# EAGLE design rhome_3 (EAGLE 6.5.0)
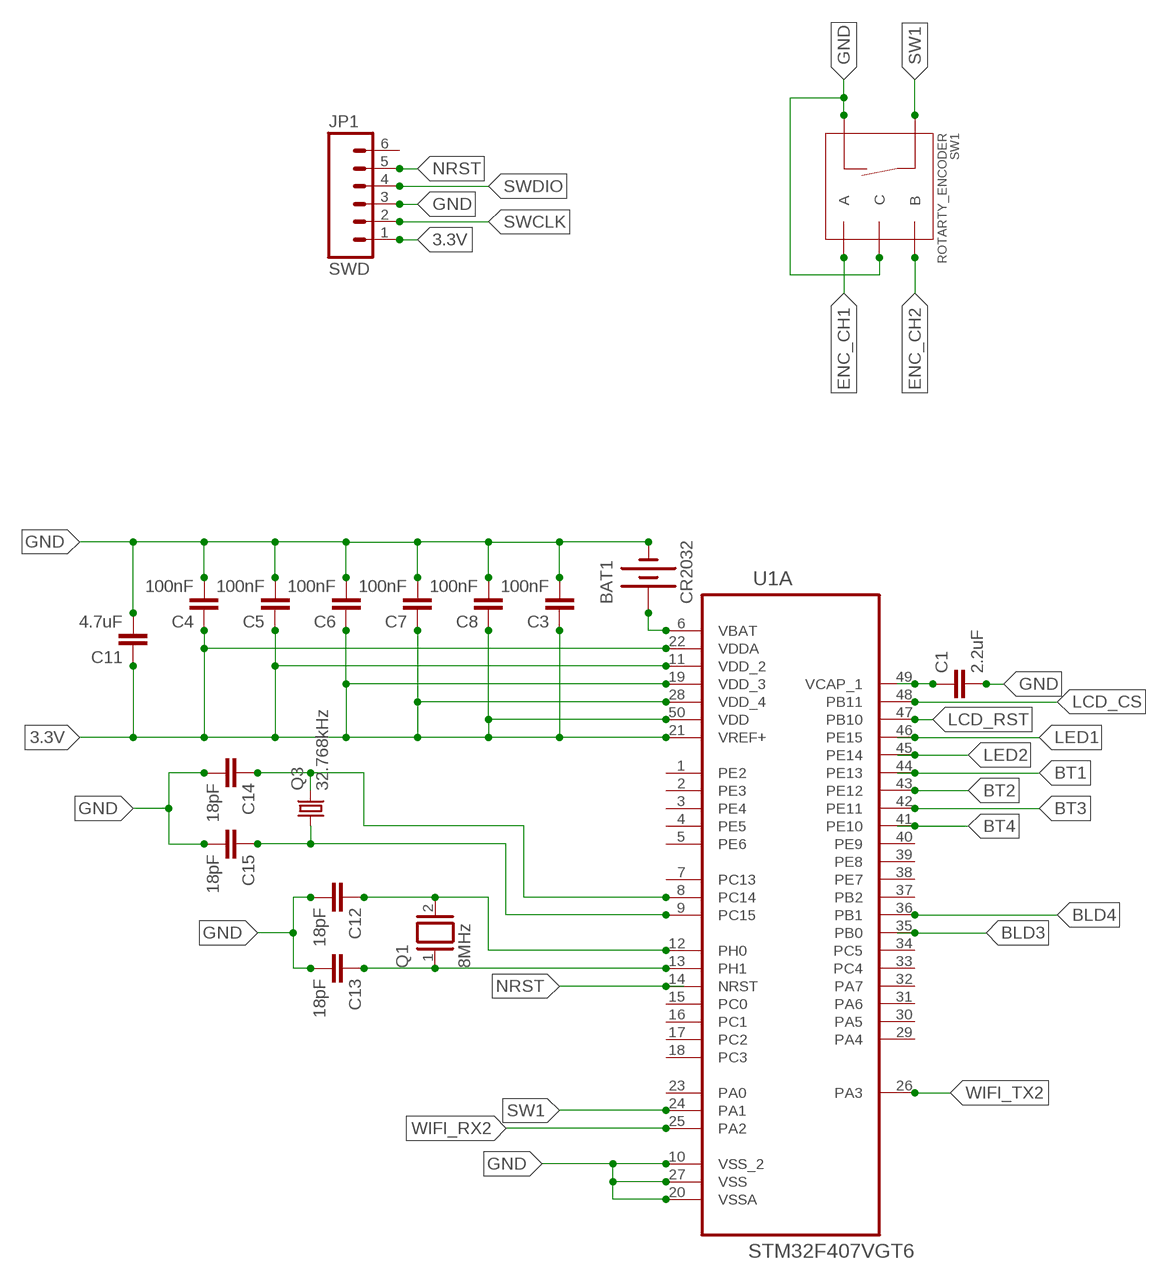
[diagram p0: schematic, sheet 1, part 1 of 2]
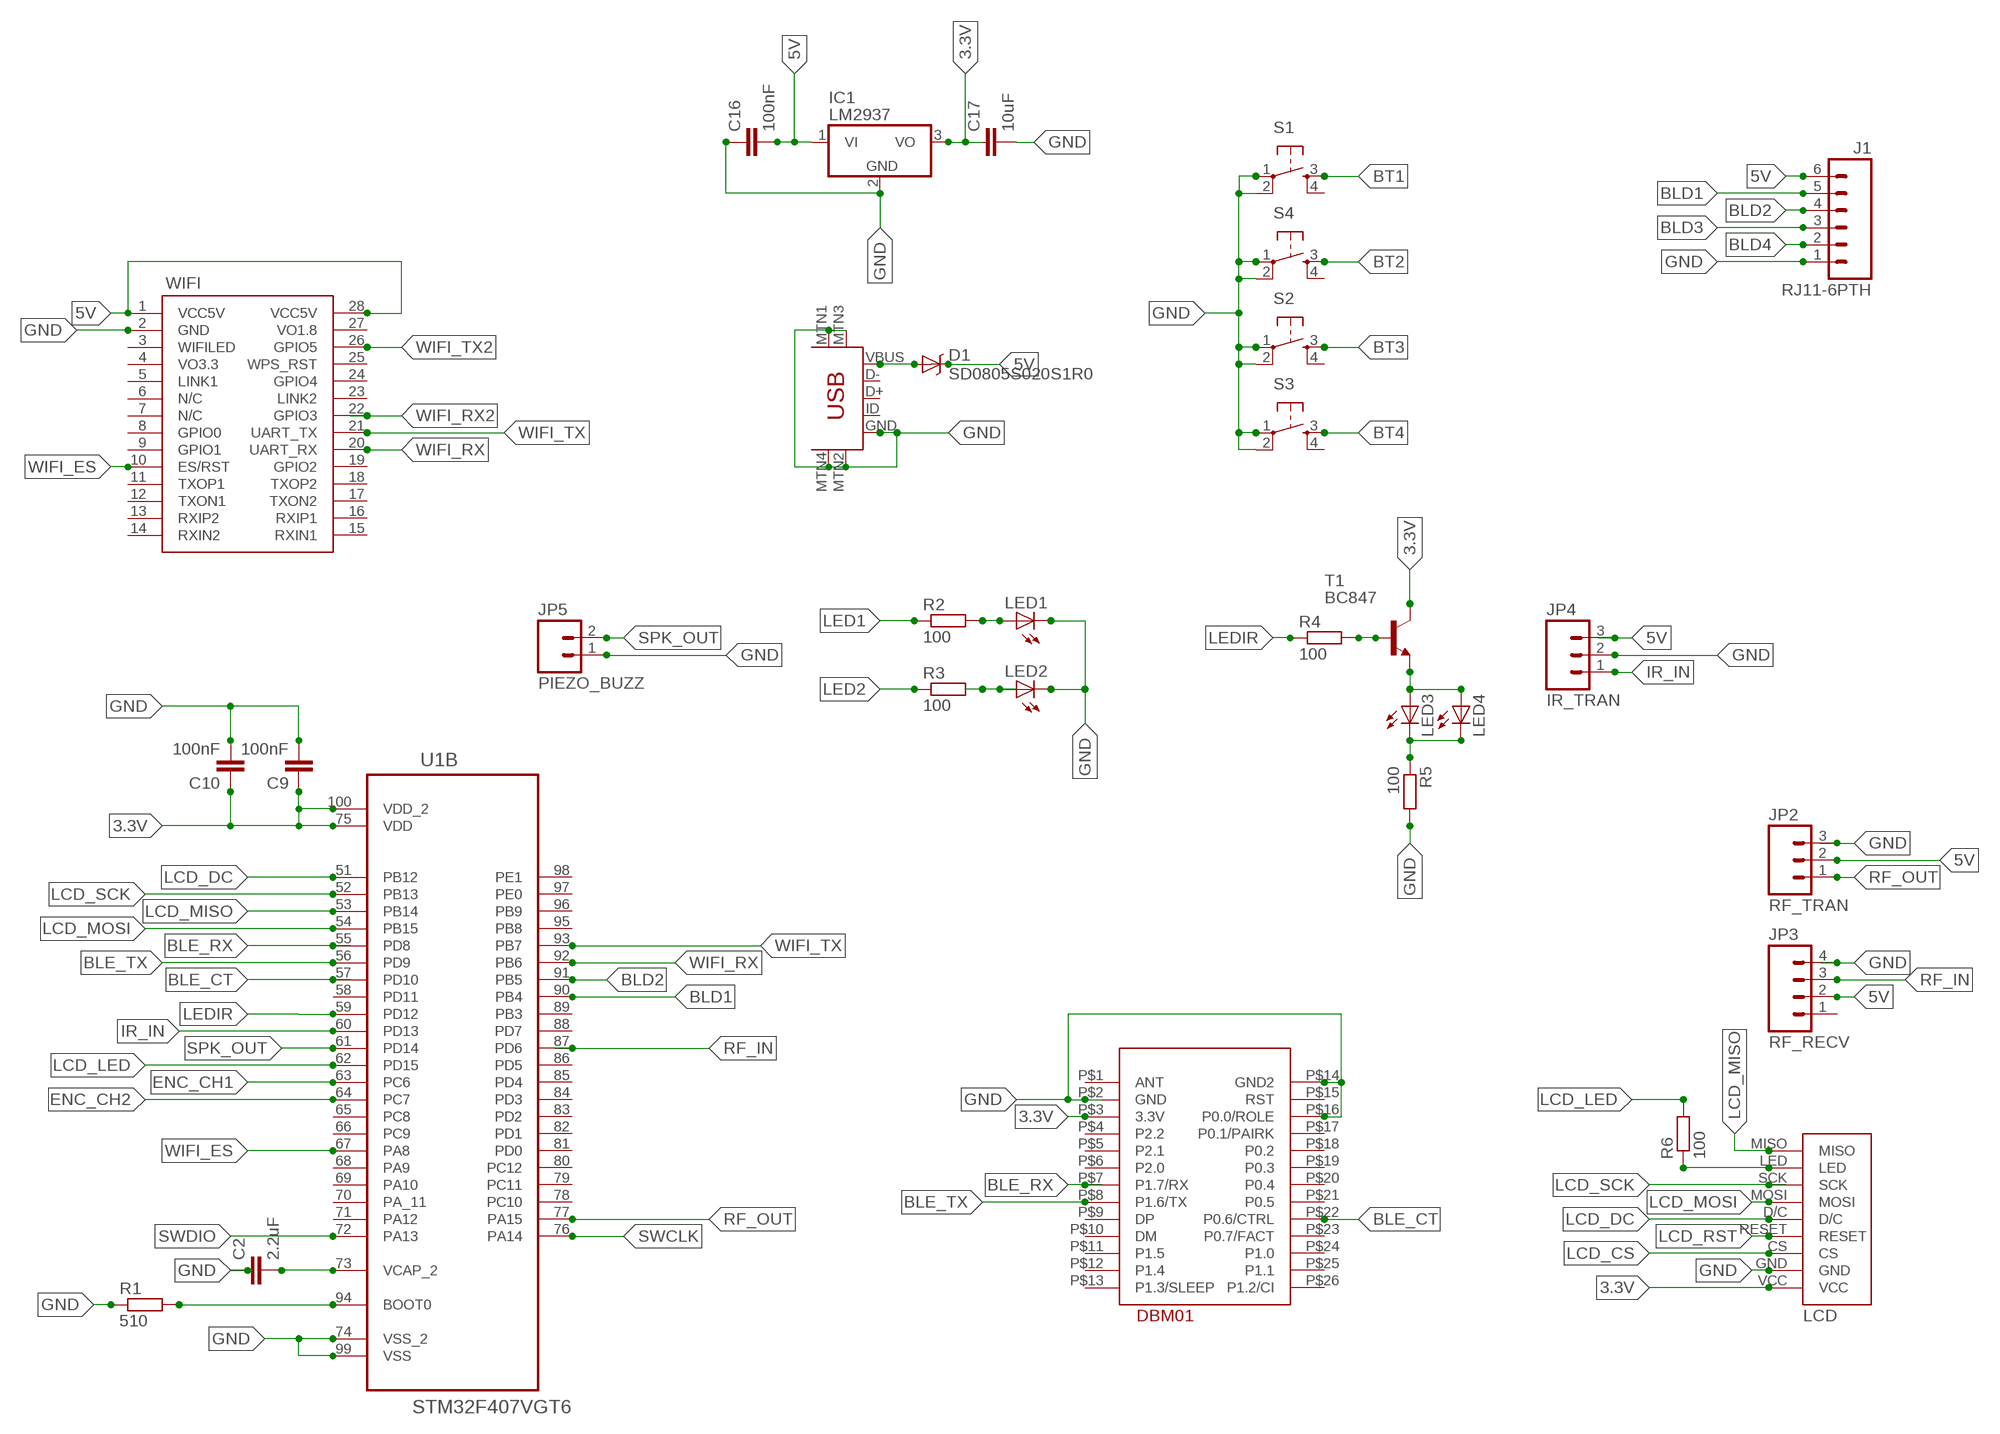
[diagram p1: schematic, sheet 1, part 2 of 2]

## Parts
BAT1  CR2032  BATTERY20SMD  [BATTCON_20MM]
C1  2.2uF  CAP0805  [0805]
C2  2.2uF  CAP0805  [0805]
C3  100nF  CAP0805  [0805]
C4  100nF  CAP0805  [0805]
C5  100nF  CAP0805  [0805]
C6  100nF  CAP0805  [0805]
C7  100nF  CAP0805  [0805]
C8  100nF  CAP0805  [0805]
C9  100nF  CAP0805  [0805]
C10  100nF  CAP0805  [0805]
C11  4.7uF  CAP0805  [0805]
C12  18pF  CAP0805  [0805]
C13  18pF  CAP0805  [0805]
C14  18pF  CAP0805  [0805]
C15  18pF  CAP0805  [0805]
C16  100nF  CAP0805  [0805]
C17  10uF  CAP0805  [0805]
D1  SD0805S020S1R0  BAT20JFILM  [SOD-323]
DBM01  DBM01  [SMD]
IC1  LM2937  [TO263-3]
J1  RJ11-6PTH  [RJ11-6]
JP1  SWD  M06SIP  [1X06]
JP2  RF_TRAN  M03PTH  [1X03]
JP3  RF_RECV  M04PTH  [1X04]
JP4  IR_TRAN  M03PTH  [1X03]
JP5  PIEZO_BUZZ  M02LOCK  [1X02_LOCK]
LCD  ILI9341_SPI_LCD  [LCD]
LED1  LED5MM  [LED5MM]
LED2  LED5MM  [LED5MM]
LED3  LED5MM  [LED5MM]
LED4  LED5MM  [LED5MM]
Q1  8MHz  XTAL/S  [QS]
Q3  32.768kHz  MC-306  [MC-306]
R1  510  R-EU_R0805  [R0805]
R2  100  R-EU_R0805  [R0805]
R3  100  R-EU_R0805  [R0805]
R4  100  R-EU_R0805  [R0805]
R5  100  R-EU_R0805  [R0805]
R6  100  R-EU_R0805  [R0805]
S1  TAC_SWITCHPTH  [TACTILE-PTH]
S2  TAC_SWITCHPTH  [TACTILE-PTH]
S3  TAC_SWITCHPTH  [TACTILE-PTH]
S4  TAC_SWITCHPTH  [TACTILE-PTH]
SW1  ROTARTY_ENCODER  [ROTARY_ENC_PLAIN]
T1  BC847  [SOT23]
U1  STM32F407VGT6  [QFP50P1600X1600X160-100N]
U$1  USB-MINIB-5PIN  [USB-MINIB]
WIFI  HLK-RM04  [HLK-RM04]

## Nets
3.3V: C3.1 C4.1 C5.1 C6.1 C7.1 C8.1 C9.1 C10.1 C11.1 C17.1 DBM01.P$3(3.3V) IC1.3(VO) JP1.1 LCD.VCC T1.3(C) U1.11(A:VDD_2) U1.19(A:VDD_3) U1.21(A:VREF+) U1.22(A:VDDA) U1.28(A:VDD_4) U1.50(A:VDD) U1.75(B:VDD) U1.100(B:VDD_2)
5V: C16.2 D1.1(C) IC1.1(VI) J1.6 JP2.2 JP3.2 JP4.3 WIFI.1(VCC5V) WIFI.28(VCC5V)
BLD1: J1.5 U1.90(B:PB4)
BLD2: J1.4 U1.91(B:PB5)
BLD3: J1.3 U1.35(A:PB0)
BLD4: J1.2 U1.36(A:PB1)
BLE_CT: DBM01.P$22(P0.6/CTRL) U1.57(B:PD10)
BLE_RX: DBM01.P$7(P1.7/RX) U1.55(B:PD8)
BLE_TX: DBM01.P$8(P1.6/TX) U1.56(B:PD9)
BT1: S1.3 U1.44(A:PE13)
BT2: S4.3 U1.43(A:PE12)
BT3: S2.3 U1.42(A:PE11)
BT4: S3.3 U1.41(A:PE10)
ENC_CH1: SW1.A U1.63(B:PC6)
ENC_CH2: SW1.B U1.64(B:PC7)
GND: BAT1.2(-) C1.2 C2.1 C3.2 C4.2 C5.2 C6.2 C7.2 C8.2 C9.2 C10.2 C11.2 C12.2 C13.2 C14.2 C15.2 C16.1 C17.2 DBM01.P$2(GND) DBM01.P$14(GND2) DBM01.P$16(P0.0/ROLE) IC1.2(GND) J1.1 JP1.3 JP2.3 JP3.4 JP4.2 JP5.1 LCD.GND LED1.K(C) LED2.K(C) R1.1 R5.2 S1.1 S1.2 S2.1 S2.2 S3.1 S3.2 S4.1 S4.2 SW1.C SW1.SW- U1.10(A:VSS_2) U1.20(A:VSSA) U1.27(A:VSS) U1.74(B:VSS_2) U1.99(B:VSS) U$1.GND U$1.MTN1(MTN2) U$1.MTN2(MTN3) U$1.MTN3(MTN1) U$1.MTN4 WIFI.2(GND)
IR_IN: JP4.1 U1.60(B:PD13)
LCD_CS: LCD.CS U1.48(A:PB11)
LCD_DC: LCD.D/C U1.51(B:PB12)
LCD_LED: R6.2 U1.62(B:PD15)
LCD_MISO: LCD.MISO U1.53(B:PB14)
LCD_MOSI: LCD.MOSI U1.54(B:PB15)
LCD_RST: LCD.RESET U1.47(A:PB10)
LCD_SCK: LCD.SCK U1.52(B:PB13)
LED1: R2.1 U1.46(A:PE15)
LED2: R3.1 U1.45(A:PE14)
LEDIR: R4.1 U1.59(B:PD12)
N$1: C2.2 U1.73(B:VCAP_2)
N$3: C1.1 U1.49(A:VCAP_1)
N$4: C14.1 Q3.4 U1.8(A:PC14)
N$5: C13.1 Q1.1 U1.13(A:PH1)
N$6: C12.1 Q1.2 U1.12(A:PH0)
N$7: C15.1 Q3.1 U1.9(A:PC15)
N$8: D1.2(A) U$1.VBUS
N$9: BAT1.1(+) U1.6(A:VBAT)
N$10: LED1.A R2.2
N$11: LED2.A R3.2
N$12: R4.2 T1.1(B)
N$13: LED3.A LED4.A T1.2(E)
N$14: R1.2 U1.94(B:BOOT0)
N$15: LED3.K(C) LED4.K(C) R5.1
N$17: LCD.LED R6.1
NRST: JP1.5 U1.14(A:NRST)
RF_IN: JP3.3 U1.87(B:PD6)
RF_OUT: JP2.1 U1.77(B:PA15)
SPK_OUT: JP5.2 U1.61(B:PD14)
SW1: SW1.SW+ U1.24(A:PA1)
SWCLK: JP1.2 U1.76(B:PA14)
SWDIO: JP1.4 U1.72(B:PA13)
WIFI_ES: U1.67(B:PA8) WIFI.10(ES/RST)
WIFI_RX: U1.92(B:PB6) WIFI.20(UART_RX)
WIFI_RX2: U1.25(A:PA2) WIFI.22(GPIO3)
WIFI_TX: U1.93(B:PB7) WIFI.21(UART_TX)
WIFI_TX2: U1.26(A:PA3) WIFI.26(GPIO5)
Unconnected: DBM01.P$1(ANT) DBM01.P$4(P2.2) DBM01.P$5(P2.1) DBM01.P$6(P2.0) DBM01.P$9(DP) DBM01.P$10(DM) DBM01.P$11(P1.5) DBM01.P$12(P1.4) DBM01.P$13(P1.3/SLEEP) DBM01.P$15(RST) DBM01.P$17(P0.1/PAIRK) DBM01.P$18(P0.2) DBM01.P$19(P0.3) DBM01.P$20(P0.4) DBM01.P$21(P0.5) DBM01.P$23(P0.7/FACT) DBM01.P$24(P1.0) DBM01.P$25(P1.1) DBM01.P$26(P1.2/CI) JP1.6 JP3.1 S1.4 S2.4 S3.4 S4.4 U1.1(A:PE2) U1.2(A:PE3) U1.3(A:PE4) U1.4(A:PE5) U1.5(A:PE6) U1.7(A:PC13) U1.15(A:PC0) U1.16(A:PC1) U1.17(A:PC2) U1.18(A:PC3) U1.23(A:PA0) U1.29(A:PA4) U1.30(A:PA5) U1.31(A:PA6) U1.32(A:PA7) U1.33(A:PC4) U1.34(A:PC5) U1.37(A:PB2) U1.38(A:PE7) U1.39(A:PE8) U1.40(A:PE9) U1.58(B:PD11) U1.65(B:PC8) U1.66(B:PC9) U1.68(B:PA9) U1.69(B:PA10) U1.70(B:PA_11) U1.71(B:PA12) U1.78(B:PC10) U1.79(B:PC11) U1.80(B:PC12) U1.81(B:PD0) U1.82(B:PD1) U1.83(B:PD2) U1.84(B:PD3) U1.85(B:PD4) U1.86(B:PD5) U1.88(B:PD7) U1.89(B:PB3) U1.95(B:PB8) U1.96(B:PB9) U1.97(B:PE0) U1.98(B:PE1) U$1.D+ U$1.D- U$1.ID WIFI.3(WIFILED) WIFI.4(VO3.3) WIFI.5(LINK1) WIFI.6(N/C) WIFI.7(N/C) WIFI.8(GPIO0) WIFI.9(GPIO1) WIFI.11(TXOP1) WIFI.12(TXON1) WIFI.13(RXIP2) WIFI.14(RXIN2) WIFI.15(RXIN1) WIFI.16(RXIP1) WIFI.17(TXON2) WIFI.18(TXOP2) WIFI.19(GPIO2) WIFI.23(LINK2) WIFI.24(GPIO4) WIFI.25(WPS_RST) WIFI.27(VO1.8)

## Library data of the parts
BAT1 = SparkFun-Electromechanical:BATTERY: Battery Holders Various common sizes : AA, AAA, 20mm coin cell and 12mm coin cell. 20MM_4LEGS, BATT-10373
C1-C17 = SparkFun-Capacitors:CAP: Capacitor Standard 0603 ceramic capacitor, and 0.1" leaded capacitor.
D1 = SparkFun-DiscreteSemi:BAT20JFILM: 23V, 1A Schottky diode, SOD-323 package; PROD_ID: DIO-11623; VALUE: BAT20JFILM
DBM01 = roli_lib:DBM01: DBM01 Bluetooth low energy module dorji.com
IC1 = linear:LM2937: LM2937-2.5, LM2937-3.3 400mA and 500mA Voltage Regulators Source: http://cache.national.com/ds/LM/LM2937-2.5.pdf
J1 = SparkFun-Connectors:RJ11-6: RJ11 Jack Simple 6 pin RJ11 jack. Commonly found on CAT3 devices and Microchip programmers. SKU: PRT-00132
JP1 = SparkFun-Connectors:M06: Header 6 Standard 6-pin 0.1" header. Use with straight break away headers (SKU : PRT-00116), right angle break away headers (PRT-00553), swiss pins (PRT-00743), machine pins (PRT-00117), and female headers (PRT-00115). Molex polarized connector foot print use with SKU : PRT-08094 with associated crimp pins and housings. NOTES ON THE VARIANTS LOCK and LOCK_LONGPADS... This footprint was designed to help hold the alignment of a through-hole component (i.e. 6-pin header) while soldering it into place. You may notice that each hole has been shifted either up or down by 0.005 of an inch from it's more standard position (which is a perfectly straight line). This slight alteration caused the pins (the squares in the middle) to touch the edges of the holes. Because they are alternating, it causes a "brace" to hold the component in place. 0.005 has proven to be the perfect amount of "off-center" position when using our standard breakaway headers. Although looks a little odd when you look at the bare footprint, once you have a header in there, the alteration is very hard to notice. Also,if you push a header all the way into place, it is covered up entirely on the bottom side. This idea of altering the position of holes to aid alignment will be further integrated into the Sparkfun Library for other footprints. It can help hold any component with 3 or more connection pins.
JP2 JP4 = SparkFun-Connectors:M03: Header 3 Standard 3-pin 0.1" header. Use with straight break away headers (SKU : PRT-00116), right angle break away headers (PRT-00553), swiss pins (PRT-00743), machine pins (PRT-00117), and female headers (PRT-00115). Molex polarized connector foot print use with SKU : PRT-08232 with associated crimp pins and housings.
JP3 = SparkFun-Connectors:M04: Header 4 Standard 4-pin 0.1" header. Use with straight break away headers (SKU : PRT-00116), right angle break away headers (PRT-00553), swiss pins (PRT-00743), machine pins (PRT-00117), and female headers (PRT-00115). Molex polarized connector foot print use with SKU : PRT-08231 with associated crimp pins and housings. 1MM SMD Version SKU: PRT-10208
JP5 = SparkFun-Connectors:M02: Standard 2-pin 0.1" header. Use with - straight break away headers ( PRT-00116) - right angle break away headers (PRT-00553) - swiss pins (PRT-00743) - machine pins (PRT-00117) - female headers (PRT-00115) Molex polarized connector foot print use with: PRT-08233 with associated crimp pins and housings. 2.54_SCREWTERM for use with PRT-10571. 3.5mm Screw Terminal footprints for PRT-08084 5mm Screw Terminal footprints for use with PRT-08433
LCD = roli_lib:ILI9341_SPI_LCD: 2.2" LCD with ILI9341 SPI controller Commonly found on ebay for a few $ 320x240 resolution
LED1-LED4 = led:LED: LED OSRAM: - CHIPLED LG R971, LG N971, LY N971, LG Q971, LY Q971, LO R971, LY R971 LH N974, LH R974 LS Q976, LO Q976, LY Q976 LO Q996 - Hyper CHIPLED LW Q18S LB Q993, LB Q99A, LB R99A - SideLED LS A670, LO A670, LY A670, LG A670, LP A670 LB A673, LV A673, LT A673, LW A673 LH A674 LY A675 LS A676, LA A676, LO A676, LY A676, LW A676 LS A679, LY A679, LG A679 - Hyper Micro SIDELED® LS Y876, LA Y876, LO Y876, LY Y876 LT Y87S - SmartLED LW L88C, LW L88S LB L89C, LB L89S, LG L890 LS L89K, LO L89K, LY L89K LS L896, LA L896, LO L896, LY L896 - TOPLED LS T670, LO T670, LY T670, LG T670, LP T670 LSG T670, LSP T670, LSY T670, LOP T670, LYG T670 LG T671, LOG T671, LSG T671 LB T673, LV T673, LT T673, LW T673 LH T674 LS T676, LA T676, LO T676, LY T676, LB T676, LH T676, LSB T676, LW T676 LB T67C, LV T67C, LT T67C, LS T67K, LO T67K, LY T67K, LW E67C LS E67B, LA E67B, LO E67B, LY E67B, LB E67C, LV E67C, LT E67C LW T67C LS T679, LY T679, LG T679 LS T770, LO T770, LY T770, LG T770, LP T770 LB T773, LV T773, LT T773, LW T773 LH T774 LS E675, LA E675, LY E675, LS T675 LS T776, LA T776, LO T776, LY T776, LB T776 LHGB T686 LT T68C, LB T68C - Hyper Mini TOPLED® LB M676 - Mini TOPLED Santana® LG M470 LS M47K, LO M47K, LY M47K Source: http://www.osram.convergy.de LUXEON: - LUMILED® LXK2-PW12-R00, LXK2-PW12-S00, LXK2-PW14-U00, LXK2-PW14-V00 LXK2-PM12-R00, LXK2-PM12-S00, LXK2-PM14-U00 LXK2-PE12-Q00, LXK2-PE12-R00, LXK2-PE12-S00, LXK2-PE14-T00, LXK2-PE14-U00 LXK2-PB12-K00, LXK2-PB12-L00, LXK2-PB12-M00, LXK2-PB14-N00, LXK2-PB14-P00, LXK2-PB14-Q00 LXK2-PR12-L00, LXK2-PR12-M00, LXK2-PR14-Q00, LXK2-PR14-R00 LXK2-PD12-Q00, LXK2-PD12-R00, LXK2-PD12-S00 LXK2-PH12-R00, LXK2-PH12-S00 LXK2-PL12-P00, LXK2-PL12-Q00, LXK2-PL12-R00 Source: www.luxeon.com KINGBRIGHT: KA-3528ASYC Source: www.kingbright.com
Q1 = special:XTAL/S: CRYSTAL
Q3 = crystal:MC-306: kHz RANGE CRYSTAL UNIT SMD Source: MC-306_405_406_E07X.PDF Homepage <http://www.epsontoyocom.co.jp>; MPN: MC-306 60.0KHZ 100PPM ,12.5PF; OC_FARNELL: 1278040; OC_NEWARK: 31M5576
R1-R6 = resistor:R-EU_: RESISTOR, European symbol
S1-S4 = SparkFun-Electromechanical:TAC_SWITCH: Momentary Switch Button commonly used for reset or general input. Spark Fun Electronics SKU : COM-00097 SMT- SWCH-08247
SW1 = SparkFun-Electromechanical:ROTARTY_ENCODER: Simple no LED rotary encoder Example: COM-09117
T1 = transistor:BC847: NPN TRANSISTOR
U1 = stm32f4:STM32F407VGT6: IC, MCU, 32BIT, 1MB FLASH, 100LQFP; MPN: STM32F407VGT6; OC_FARNELL: 2064368; OC_NEWARK: 73T2333; PACKAGE: 100LQFP; SUPPLIER: STMicroelectronics
U$1 = SparkFun-Connectors:USB-MINIB: Mini-USB "B" connector with 5th pin broken out. Created new symbol breaking out 5th "ID" pin in mini/micro USB connector spec. See: http://en.wikipedia.org/wiki/Mini_usb#Cables. Uses same footprint as 4-pin symbol. Also added pins to connect to mounting / shield pads if required (probably not generally needed as signals aren't shielded once they leave the connector).
WIFI = solderandflux:HLK-RM04

## Net classes
0 default: width 0.152 mm, drill 0.33 mm, clearance 0.152 mm

## Board
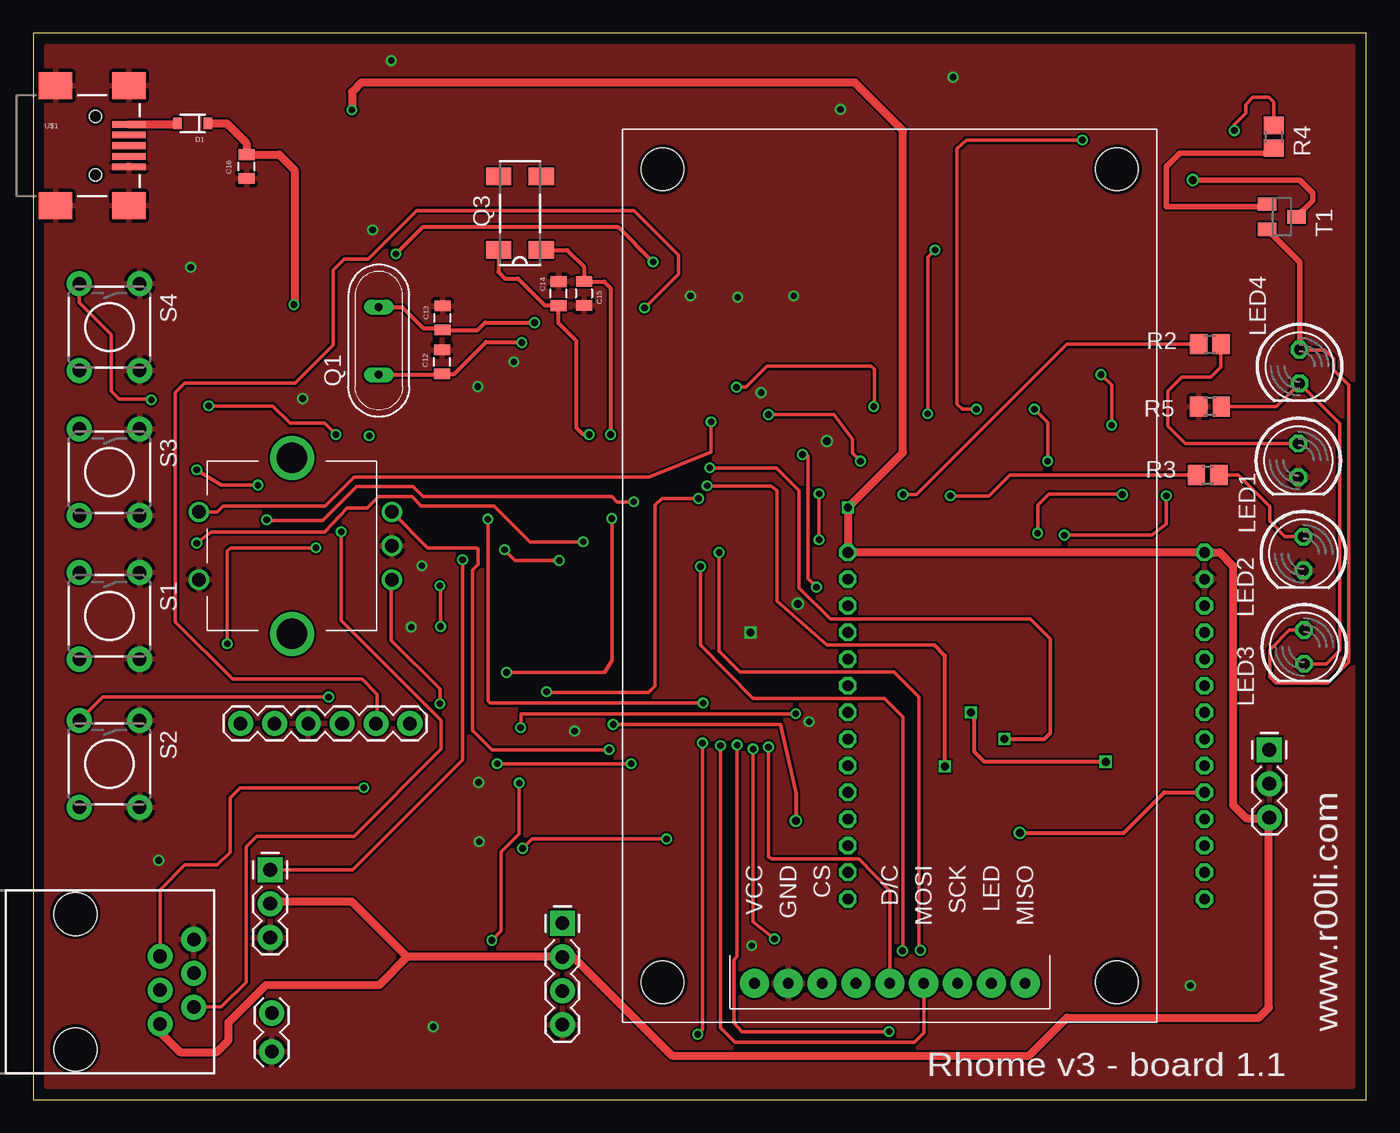
[diagram p2: board, top side]
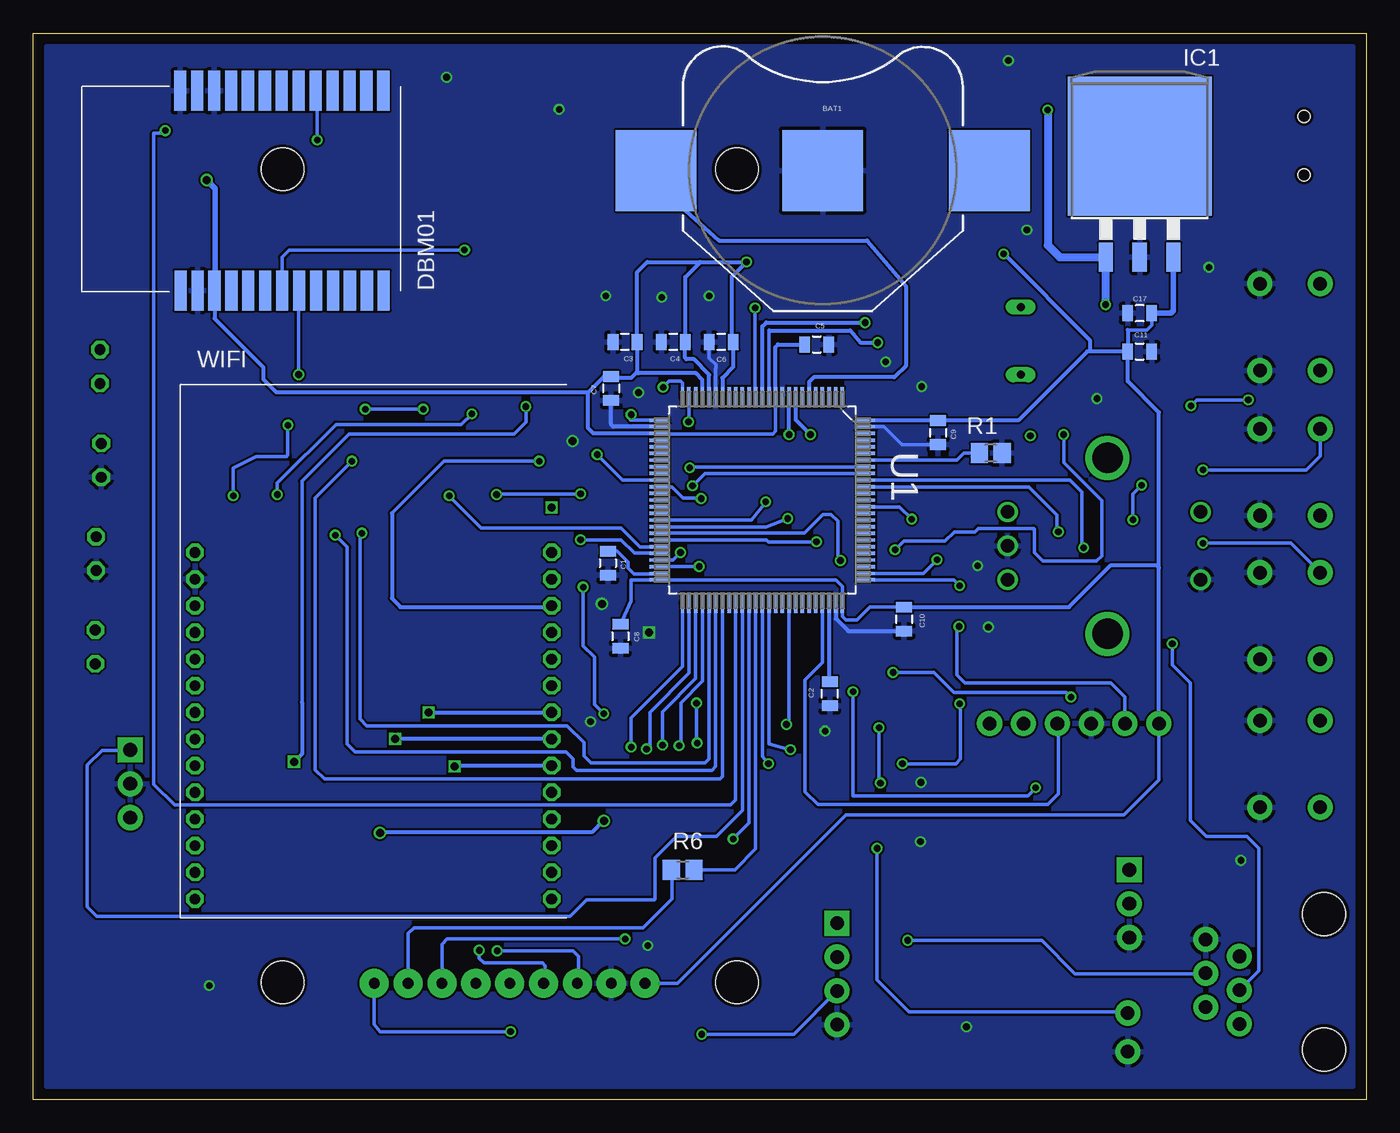
[diagram p3: board, bottom side, seen from below]

Size 100 x 80 mm. Coordinates in mm from the lower left corner, seen from the top.
Outline: 0,80 0,0 100,0 100,80 0,80
Copper layers (1*16): Top 0.035mm / dielectric 1.5mm / Bottom 0.035mm
Design rules "Elecrow_2-layer_eagle_rule": minimum track width 6mil, minimum drill 12mil, track to track 6mil, track to pad 6mil, pad to pad 6mil, via to via 6mil, smd to smd 0mil, copper to edge 10mil, drill to drill 10mil, minimum pad ring 10mil, minimum via ring 6mil, stop-mask expansion 2mil, vias tented up to drill 100mil, thermal gap 10mil

### Footprints (pad centres in the part's own frame; a part is rotated, then mirrored left to right if it is on the bottom)
BATTCON_20MM = smd 6.07 x 6.07: 1 -12.5,0; 2 0,0; 3 12.5,0
0805 = smd 0.8 x 1.2: 1 -0.9,0; 2 0.9,0
SOD-323 = smd 0.63 x 0.83: 1 -1.15,0; 2 1.15,0
SMD = smd 3 x 0.91: P$1 -7.62,6.35; P$2 -7.62,5.08; P$3 -7.62,3.81; P$4 -7.62,2.54; P$5 -7.62,1.27; P$6 -7.62,0; P$7 -7.62,-1.27; P$8 -7.62,-2.54; P$9 -7.62,-3.81; P$10 -7.62,-5.08; P$11 -7.62,-6.35; P$12 -7.62,-7.62; P$13 -7.62,-8.89; P$14 7.36,6.38; P$15 7.36,5.11; P$16 7.36,3.84; P$17 7.36,2.57; P$18 7.36,1.3; P$19 7.36,0.03; P$20 7.36,-1.24; P$21 7.36,-2.51; P$22 7.36,-3.78; P$23 7.36,-5.05; P$24 7.36,-6.32; P$25 7.36,-7.59; P$26 7.36,-8.86
TO263-3 = smd 1.067 x 2.159: 1 -2.54,-5.791; 2 0,-5.791; 3 2.54,-5.791 | smd 10.8 x 10.41: TAB 0,2.54
RJ11-6 = drill 1.016 pad 1.88: 1 1.905,8.89; 2 3.175,6.35; 3 4.445,8.89; 4 5.715,6.35; 5 6.985,8.89; 6 8.255,6.35 | hole 3.251: 0,0; 10.16,0
1X06 = drill 1.016 pad 1.88: 1 0,0; 2 2.54,0; 3 5.08,0; 4 7.62,0; 5 10.16,0; 6 12.7,0
1X03 = drill 1.016 pad 1.88 square: 1 0,0 | drill 1.016 pad 1.88: 2 2.54,0; 3 5.08,0
1X04 = drill 1.016 pad 1.88 square: 1 0,0 | drill 1.016 pad 1.88: 2 2.54,0; 3 5.08,0; 4 7.62,0
1X02_LOCK = drill 1.016 pad 1.88: 1 -0.178,0; 2 2.718,0
LCD = drill 0.8 pad 2.184: CS 30.48,-5.08; D/C 30.48,0; GND 30.48,-7.62; LED 30.48,7.62; MISO 30.48,10.16; MOSI 30.48,2.54; RESET 30.48,-2.54; SCK 30.48,5.08; VCC 30.48,-10.16 | hole 3.2: 30.4,17.05; 30.4,-17.05; -30.6,17.05; -30.6,-17.05
LED5MM = drill 0.813 octagon: A -1.27,0; K 1.27,0
QS = drill 0.61 long: 1 -2.54,0; 2 2.54,0
MC-306 = smd 1.3 x 1.9: 1 -2.75,-1.6; 2 2.75,-1.6; 3 2.75,1.6; 4 -2.75,1.6
R0805 = smd 1.3 x 1.5: 1 -0.85,0; 2 0.85,0
TACTILE-PTH = drill 1.016 pad 1.88: 1 -3.251,2.261; 2 3.251,2.261; 3 -3.251,-2.261; 4 3.251,-2.261
ROTARY_ENC_PLAIN = drill 1.016: A 7.493,-2.54; B 7.493,2.54; C 7.493,0; SW+ -6.985,2.54; SW- -6.985,-2.54 | drill 2.286: P$3 0,6.604; P$4 0,-6.604
SOT23 = smd 1 x 1.4: 1 -0.95,-1.1; 2 0.95,-1.1; 3 0,1.1
QFP50P1600X1600X160-100N = smd 1.473 x 0.254: 1 -7.722,5.994; 2 -7.722,5.512; 3 -7.722,5.004; 4 -7.722,4.496; 5 -7.722,3.988; 6 -7.722,3.505; 7 -7.722,2.997; 8 -7.722,2.489; 9 -7.722,2.007; 10 -7.722,1.499; 11 -7.722,0.991; 12 -7.722,0.508; 13 -7.722,0; 14 -7.722,-0.508; 15 -7.722,-0.991; 16 -7.722,-1.499; 17 -7.722,-2.007; 18 -7.722,-2.489; 19 -7.722,-2.997; 20 -7.722,-3.505; 21 -7.722,-3.988; 22 -7.722,-4.496; 23 -7.722,-5.004; 24 -7.722,-5.512; 25 -7.722,-5.994; 51 7.722,-5.994; 52 7.722,-5.512; 53 7.722,-5.004; 54 7.722,-4.496; 55 7.722,-3.988; 56 7.722,-3.505; 57 7.722,-2.997; 58 7.722,-2.489; 59 7.722,-2.007; 60 7.722,-1.499; 61 7.722,-0.991; 62 7.722,-0.508; 63 7.722,0; 64 7.722,0.508; 65 7.722,0.991; 66 7.722,1.499; 67 7.722,2.007; 68 7.722,2.489; 69 7.722,2.997; 70 7.722,3.505; 71 7.722,3.988; 72 7.722,4.496; 73 7.722,5.004; 74 7.722,5.512; 75 7.722,5.994 | smd 0.254 x 1.473: 26 -5.994,-7.722; 27 -5.512,-7.722; 28 -5.004,-7.722; 29 -4.496,-7.722; 30 -3.988,-7.722; 31 -3.505,-7.722; 32 -2.997,-7.722; 33 -2.489,-7.722; 34 -2.007,-7.722; 35 -1.499,-7.722; 36 -0.991,-7.722; 37 -0.508,-7.722; 38 0,-7.722; 39 0.508,-7.722; 40 0.991,-7.722; 41 1.499,-7.722; 42 2.007,-7.722; 43 2.489,-7.722; 44 2.997,-7.722; 45 3.505,-7.722; 46 3.988,-7.722; 47 4.496,-7.722; 48 5.004,-7.722; 49 5.512,-7.722; 50 5.994,-7.722; 76 5.994,7.722; 77 5.512,7.722; 78 5.004,7.722; 79 4.496,7.722; 80 3.988,7.722; 81 3.505,7.722; 82 2.997,7.722; 83 2.489,7.722; 84 2.007,7.722; 85 1.499,7.722; 86 0.991,7.722; 87 0.508,7.722; 88 0,7.722; 89 -0.508,7.722; 90 -0.991,7.722; 91 -1.499,7.722; 92 -2.007,7.722; 93 -2.489,7.722; 94 -2.997,7.722; 95 -3.505,7.722; 96 -3.988,7.722; 97 -4.496,7.722; 98 -5.004,7.722; 99 -5.512,7.722; 100 -5.994,7.722
USB-MINIB = smd 2.5 x 0.5: D+ 2.5,0; D- 2.5,0.8; GND 2.5,-1.6; ID 2.5,-0.8; VBUS 2.5,1.6 | smd 2.5 x 2: MTN1 -3,4.5; MTN2 2.5,4.5; MTN3 -3,-4.5; MTN4 2.5,-4.5 | hole 0.9: 0,2.2; 0,-2.2
HLK-RM04 = drill 0.8 octagon: 1 1.125,-12.59; 2 1.125,-14.59; 3 1.125,-16.59; 4 1.125,-18.59; 5 1.125,-20.59; 6 1.125,-22.59; 7 1.125,-24.59; 8 1.125,-26.59; 9 1.125,-28.59; 10 1.125,-30.59; 11 1.125,-32.59; 12 1.125,-34.59; 13 1.125,-36.59; 14 1.125,-38.59; 15 27.875,-38.59; 16 27.875,-36.59; 17 27.875,-34.59; 18 27.875,-32.59; 19 27.875,-30.59; 20 27.875,-28.59; 21 27.875,-26.59; 22 27.875,-24.59; 23 27.875,-22.59; 24 27.875,-20.59; 25 27.875,-18.59; 26 27.875,-16.59; 27 27.875,-14.59; 28 27.875,-12.59

### Placement (x,y rotation side)
BAT1  40.77,69.71 0 bottom
C1  56.9,40.24 270 bottom
C2  40.25,30.45 90 bottom
C3  55.61,56.85 180 bottom
C4  51.98,56.85 180 bottom
C5  41.22,56.65 0 bottom
C6  48.39,56.85 180 bottom
C7  56.65,53.35 270 bottom
C8  55.95,34.76 270 bottom
C9  32.13,50.04 270 bottom
C10  34.68,36.05 270 bottom
C11  16.99,56.13 0 bottom
C12  30.65,55.35 90 top
C13  30.7,58.64 90 top
C14  39.4,60.47 90 top
C15  41.3,60.48 270 top
C16  16,70 90 top
C17  17,59 180 bottom
D1  11.95,73.24 180 top
DBM01  82.6,68.32 90 bottom
IC1  17,69 0 bottom
J1  3.15,13.92 270 top
JP1  15.55,28.21 0 top
JP2  17.77,17.23 270 top
JP3  39.69,13.23 270 top
JP4  92.73,26.23 270 top
JP5  17.89,3.77 90 top
LCD  64.26,39.2 270 top
LED1  94.91,47.96 270 top
LED2  95.29,40.96 270 top
LED3  95.35,33.96 270 top
LED4  95,55 270 top
Q1  25.92,56.93 270 top
Q3  36.5,66.5 90 top
R1  28.17,48.5 180 bottom
R2  88.27,56.67 0 top
R3  88.1,46.86 0 top
R4  93.05,72.23 270 top
R5  88.28,51.99 180 top
R6  51.28,17.23 0 bottom
S1  5.71,36.29 270 top
S2  5.71,25.18 270 top
S3  5.71,47.07 270 top
S4  5.71,57.96 270 top
SW1  19.41,41.54 0 top
T1  93.67,66.23 270 top
U1  45.3,44.98 270 bottom
U$1  4.67,71.57 0 top
WIFI  88.99,53.64 0 bottom

### Tracks (layer width: path | path; a pad name or v marks a point on that pad's centre or on a via)
3.3V  (via drill 0.5, 0.6)
  Top 0.305: v46.5,62.85 43.9,65.45 29.2,65.45 v27.2,63.45
  Top 0.406: T1.3 96,67.46 96,68 95,69 v87,69
  Bottom 0.279: 44.31,56.49 44.31,50.14 44.5,49.95 52.99,49.95 U1.28 | C8.1 55.15,37.4 55.15,39 53.04,39 | 53.04,39 U1.50 | C10.1 37.25,36.95 38.2,36 39.05,36 39.31,36.26 U1.75 39.3,38.5 39.8,39 53.04,39 | LCD.VCC 51.68,8.72 39.05,21.35 18.2,21.35 15.55,24 JP1.1 | 17.9,57.74 16.46,57.74 16.1,58.1 C17.1
  Bottom 0.305: U1.19 48.3,54.15 47.49,54.96 C6.1 47.49,56.94 47.6,57.05 47.6,61.75 v46.5,62.85 49.95,62.85 | 17.9,57.74 C11.1 | C11.1 20.75,56.13 | 20.75,56.13 20.92,56.13 26.1,50.95 C9.1 37.54,50.94 U1.100 | JP1.1 15.55,39.9 | 15.55,39.9 15.55,51.55 17.9,53.9 C11.1 | C10.1 22.3,36.95 19.15,40.1 15.75,40.1 15.55,39.9 | v27.2,63.45 20.75,57 20.75,56.13 | 49.95,62.85 53.95,62.85 54.7,62.1 C3.1 54.71,54.59 | 49.95,62.85 51.08,61.72 C4.1 51.1,56.83 51.1,55.65 51,55.55 50.45,55.55 49.29,54.39 U1.21 | 54.71,54.59 55.15,54.15 56.55,54.15 C7.1 57.2,54.25 58.4,53.05 | 58.4,53.05 58.4,50.4 57.98,49.98 U1.28 | 58.4,53.05 81.75,53.05 82.75,54.05 82.75,54.95 86.41,58.61 DBM01.P$3 | U1.22 49.8,54 50.3,54.5 54.62,54.5 54.71,54.59 | U1.11 44.31,56.49 44.15,56.65 C5.1
  Bottom 0.406: v87,69 86.36,68.36 86.36,61.72 86.41,61.67 DBM01.P$3 | IC1.3 14.48,63.19 14.48,59.18 14.66,59 C17.1
5V  (via drill 0.5, 0.6)
  Top 0.61: 28.06,10.69 JP3.2 40.51,10.69 47.9,3.3 74.7,3.3 77.55,6.15 91.95,6.15 92.7,6.9 92.7,21.12 JP4.3 92.68,21.1 91,21.1 90,22.1 90,40.05 89,41.05 WIFI.1 WIFI.28 v61.12,44.41 65.25,48.55 65.25,72.7 61.65,76.3 24.6,76.3 23.9,75.6 v23.9,74.25 | 28.06,10.69 23.9,14.85 17.93,14.85 JP2.2 | J1.6 9.51,5.04 11,3.55 13.75,3.55 14.65,4.45 14.65,5.8 17.45,8.6 25.97,8.6 28.06,10.69 | D1.1 14.51,73.24 16,71.75 C16.2 18.45,70.9 19.6,69.75 19.6,59.7 v19.55,59.65
  Bottom 0.61: v23.9,74.25 23.9,64.1 23,63.2 IC1.1 19.55,63.2 v19.55,59.65
BLD1  (via drill 0.5)
  Top 0.279: v23.1,42.6 23.1,35.95 30.6,28.45 30.6,26.3 24.05,19.75 16.75,19.75 15.95,18.95 15.95,8.8 14.1,6.95 12.06,6.95 J1.5
  Bottom 0.279: U1.90 25.32,45.97 23.2,43.85 23.2,42.7 v23.1,42.6
BLD2  (via drill 0.5)
  Top 0.279: v21.2,41.4 14.8,41.4 14.55,41.15 v14.55,34.2
  Bottom 0.279: U1.91 22.23,46.48 21.35,45.6 21.35,41.55 v21.2,41.4 | v14.55,34.2 14.55,32.6 13.2,31.25 13.2,20.95 12,19.75 8.95,19.75 8.05,18.85 8.05,9.66 J1.4
BLD3  (via drill 0.5)
  Top 0.279: v57.7,48.4 58,48.4 58.1,48.3 58.1,39.1 v58.75,38.45 | v57.2,28.95 36.6,28.95 36.6,27.95 v36.55,27.9 | v36.45,23.75 36.45,19.95 35.1,18.6 35.1,12.65 v34.4,11.95
  Bottom 0.279: U1.35 55.78,46.48 v57.7,48.4 | v58.75,38.45 58.75,34.05 57.9,33.2 57.9,29.65 v57.2,28.95 | v36.55,27.9 36.55,23.85 v36.45,23.75 | v34.4,11.95 24.35,11.95 21.85,9.45 12.07,9.45 J1.3
BLD4  (via drill 0.5)
  Top 0.279: v49.9,45.1 47.15,45.1 46.65,44.6 46.65,31.05 46.15,30.55 38.55,30.55 v38.5,30.6 | v24.8,23.4 15.5,23.4 14.75,22.65 14.75,18.55 13.8,17.6 11.35,17.6 9.5,15.75 J1.2
  Bottom 0.279: U1.36 52.07,45.97 51.25,45.15 49.95,45.15 v49.9,45.1 | v38.5,30.6 38.5,22.8 25.4,22.8 v24.8,23.4
BLE_CT  (via drill 0.5)
  Top 0.279: v76.1,47.9 76.1,50.8 v75.1,51.8 | v70.75,51.8 69.7,51.8 69.3,52.2 69.3,71.35 70,72 v78.7,72
  Bottom 0.279: U1.57 48.3,24.25 48.5,24.05 78.15,24.05 78.85,24.75 78.85,45.15 v76.1,47.9 | v75.1,51.8 v70.75,51.8 | v78.7,72 78.7,75.56 DBM01.P$22
BLE_RX  (via drill 0.5)
  Top 0.279: v75.35,42.5 75.35,44.6 76.2,45.45 81.65,45.45 v81.7,45.4 | v67.1,51.45 67.1,63.2 v67.65,63.75
  Bottom 0.279: U1.55 49.29,25.56 49.6,25.25 58.15,25.25 58.7,25.8 58.7,26.8 59.95,28.05 75,28.05 75.5,28.55 75.5,42.35 v75.35,42.5 | v81.7,45.4 81.7,46.25 77.3,50.65 67.9,50.65 v67.1,51.45 | v67.65,63.75 80.8,63.75 81.35,63.2 81.35,60.72 DBM01.P$7
BLE_TX  (via drill 0.5)
  Top 0.279: v77.35,42.35 83.9,42.35 85,43.2 v85,45.3 | v80.9,50.6 80.9,53.6 v80.1,54.4
  Bottom 0.279: U1.56 48.8,25 49.1,24.7 59.25,24.7 59.5,24.95 59.5,25.55 60.05,26.1 75.85,26.1 76.45,26.7 76.45,41.45 v77.35,42.35 | v85,45.3 85,47.4 83.3,48.25 81,48.25 80.9,48.35 v80.9,50.6 | v80.1,54.4 80.1,60.66 DBM01.P$8
BT1  (via drill 0.5)
  Top 0.279: v41.25,41.85 37.25,41.85 34.55,44.55 29.1,44.55 28.4,45.25 25.9,45.25 25.05,44.4 23.55,44.4 21.85,42.6 13.35,42.6 v12.25,41.75
  Bottom 0.279: U1.44 44.98,41.98 44.85,41.85 v41.25,41.85 | v12.25,41.75 5.66,41.75 S1.3
BT2  (via drill 0.5)
  Top 0.279: S4.3 3.45,59.8 5.85,57.4 5.85,53.15 6.45,52.55 8.8,52.55 v8.85,52.5 | v13.15,52.05 17.95,52.05 19.25,50.75 21.85,50.75 v22.7,49.9 | v39.45,40.45 36.15,40.45 v35.35,41.25
  Bottom 0.279: v8.85,52.5 12.7,52.5 v13.15,52.05 | U1.43 42.16,42.49 40.75,43.9 40.15,43.9 39.65,43.4 39.65,40.65 v39.45,40.45 | v35.35,41.25 34.7,41.9 31.6,41.9 30.9,42.6 29.35,42.6 29.1,42.85 24.95,42.85 24.9,42.8 24.9,41.05 24.25,40.4 20.25,40.4 19.85,40.8 19.85,44.95 22.7,47.8 v22.7,49.9
BT3  (via drill 0.5)
  Top 0.279: v43.4,43.6 43.4,32.95 42.85,32.05 v35.5,32.05 | v22.15,30.2 5.22,30.2 S2.3
  Bottom 0.279: U1.42 45.03,42.97 v43.4,43.6 | v35.5,32.05 32.45,32.05 30.95,30.55 22.5,30.55 v22.15,30.2
BT4  (via drill 0.5)
  Top 0.279: v45.05,44.85 43.8,44.85 43.4,45.25 29.25,45.25 28.5,46 24.25,46 21.7,43.45 17.55,43.45 v17.5,43.5 | v16.85,46.1 14.1,46.1 v12.25,47.25
  Bottom 0.279: U1.41 46.12,43.48 v45.05,44.85 | v17.5,43.5 17.5,45.45 v16.85,46.1 | v12.25,47.25 4.5,47.25 3.45,48.3 S3.3
ENC_CH1  (via drill 0.5)
  Top 0.279: v44.85,25.2 v34.8,25.2 | v30.5,29.7 30.5,30.8 26.85,34.45 26.85,38.95 SW1.A
  Bottom 0.279: U1.63 45.3,25.75 v44.85,25.2 | v34.8,25.2 30.8,25.2 30.45,25.55 30.45,29.85 v30.5,29.7
ENC_CH2  (via drill 0.5)
  Top 0.279: v43.2,26.25 34.4,26.25 32.95,27.7 32.95,39.75 33.35,40.15 33.35,41.3 33.25,41.4 29.59,41.4 SW1.B
  Bottom 0.279: U1.64 44.79,26.69 v43.2,26.25
GND  (via drill 0.5, 0.6)
  Bottom 0.279: U1.99 36.19,50.49 34.85,49.15 C9.2 | C6.2 49.3,55.65 48.8,55.15 48.8,54.9 U1.20
  Bottom 0.305: U1.74 39.79,36.09 38.85,35.15 C10.2 | C7.2 56.65,50.65 56.49,50.49 U1.27
  other vias: 57.05,60.3 52.85,60.2 26.85,77.95 25.45,65.25 20.2,52.6 9.4,17.95 30,5.45 86.8,8.55 69,76.7 60.55,74.3 36.05,55.35 33.35,53.5 49.3,60.3 33.45,19.35 33.4,23.8 54.6,53.05 11.8,62.45 58.2,28.35 53.9,11.55 40.6,27.65 29.15,40.05 28.35,35.45 53.8,35.05 57.35,37.2 59.55,49.4
  pour Top: 99,79 99,1 1,1 1,79
  pour Bottom: 99,79 99,1 1,1 1,79
IR_IN
  Bottom 0.279: U1.60 46.8,21.7 48.75,19.75 51.75,19.75 53.35,18.15 53.35,15.05 53.4,15 58.5,15 59.75,13.75 95.25,13.75 95.95,14.45 95.95,25.1 94.85,26.2 92.76,26.2 JP4.1
LCD_CS  (via drill 0.5)
  Top 0.279: v50.05,40 50.05,34.1 54,30.1 63.85,30.1 65.25,28.7 65.25,11.2 v65.2,11.15
  Bottom 0.279: U1.48 51.13,39.98 v50.05,40 | v65.2,11.15 59.5,11.15 59.1,10.75 59.1,8.8 LCD.CS
LCD_DC  (via drill 0.5)
  Top 0.279: v55.15,26.45 55.15,18.2 55.4,18.05 61.95,18.05 64.25,15.65 LCD.D/C
  Bottom 0.279: U1.51 51.29,32.51 55.15,28.65 v55.15,26.45
LCD_LED
  Bottom 0.279: R6.2 47.37,17.23 45.81,18.79 U1.62
LCD_MISO  (via drill 0.5)
  Top 0.279: v64.2,5.1 53.15,5.1 52.55,5.75 52.55,10.5 52.8,10.75 v52.8,26.6
  Bottom 0.279: U1.53 50.3,31.6 52.8,29.1 v52.8,26.6 | v64.2,5.1 74,5.1 74.45,5.65 74.45,8.69 LCD.MISO
LCD_MOSI  (via drill 0.5)
  Top 0.279: v51.55,26.55 51.55,5.4 52.65,4.3 66.1,4.3 66.8,5 LCD.MOSI
  Bottom 0.279: U1.54 49.8,31.4 51.4,29.75 51.4,26.7 v51.55,26.55
LCD_RST  (via drill 0.5)
  Top 0.279: v51.45,41.05 51.45,33.65 53,32.1 64.55,32.1 66.45,30.2 66.45,11.3 v66.55,11.2
  Bottom 0.279: U1.47 52.02,40.48 v51.45,41.05 | v66.55,11.2 66.55,10.6 66.2,10.25 61.8,10.25 61.6,10.05 61.6,8.84 LCD.RESET
LCD_SCK  (via drill 0.5)
  Top 0.279: v54,26.3 54,13.35 v55.6,12.05 | LCD.SCK
  Bottom 0.279: U1.52 50.81,31.99 53.75,29.05 53.75,26.55 v54,26.3 | v55.6,12.05 68.95,12.05 69.35,11.65 LCD.SCK
LED1  (via drill 0.5)
  Top 0.279: v58.95,42 v58.95,45.45 | v65.25,45.4 66.25,45.4 77.55,56.7 87.39,56.7 R2.1
  Bottom 0.279: U1.46 54.89,40.99 55.9,42 v58.95,42 | v58.95,45.45 65.2,45.45 v65.25,45.4
LED2  (via drill 0.5)
  Top 0.279: v68.8,45.3 71.7,45.3 73.25,46.85 R3.1
  Bottom 0.279: U1.45 54.48,41.48 55.9,42.9 66.4,42.9 v68.8,45.3
LEDIR  (via drill 0.5)
  Top 0.279: v90.1,72.7 90.1,73.15 90.95,74 90.95,74.65 91.5,75.2 92.7,75.2 93.05,74.85 R4.1
  Bottom 0.279: U1.59 47.31,22.49 47.7,22.1 89.4,22.1 90.95,23.65 90.95,72.5 90.3,72.5 v90.1,72.7
N$1
  Bottom 0.305: U1.73 40.3,31.4 C2.2
N$2  (via drill 0.5)
  other vias: 25.2,49.8
N$3
  Bottom 0.279: C1.1 56.19,41.14 55.4,40.35 55.4,39.9 54.95,39.45 53.04,39.45 U1.49
N$4  (via drill 0.5)
  Top 0.305: Q3.4 34.9,62.1 35.4,61.6 36.35,61.6 38.38,59.57 C14.1 39.4,58.25 40.75,56.9 40.75,50.4 41.25,49.9 v41.7,49.9
  Bottom 0.305: U1.8 42.81,51.01 v41.7,49.9
N$5  (via drill 0.5)
  Top 0.305: Q1.1 27.68,59.47 29.25,57.9 30.54,57.9 C13.1 33.34,57.74 33.9,58.3 v37.6,58.3
  Bottom 0.305: U1.13 45.3,58 45,58.3 v37.6,58.3
N$6  (via drill 0.5)
  Top 0.305: v36.65,56.8 36.6,56.85 33.95,56.85 31.55,54.45 C12.1 30.59,54.39 Q1.2
  Bottom 0.279: 44.8,57.7 U1.12
  Bottom 0.305: 44.8,57.7 38.7,57.7 37.95,56.8 v36.65,56.8
N$7  (via drill 0.5)
  Top 0.305: Q3.1 40.05,63.75 41.3,62.5 C15.1 42.82,61.38 43.3,60.9 v43.3,49.9
  Bottom 0.305: v43.3,49.9 U1.9
N$8
  Top 0.406: 10.8,73.17 D1.2
  Top 0.61: U$1.VBUS 10.73,73.17 D1.2
N$9
  Bottom 0.305: BAT1.1 53.27,68.67 48.55,64.45 37.45,64.45 34.55,61.05 34.55,55.05 35.4,54.2 41.45,54.2 41.8,53.85 U1.6
N$10
  Top 0.279: LED1.A 86.42,49.23 85.1,50.55 85.1,53.15 86.15,54.2 88.35,54.2 89.1,54.95 89.1,56.65 R2.2
N$11
  Top 0.279: R3.2 90.39,46.86 92.75,44.5 92.75,43.4 93.9,42.25 95.27,42.25 LED2.A
N$12
  Top 0.406: R4.2 92.67,71 86,71 85,70 85,67 93,67 92.82,67.18 T1.1
N$13
  Top 0.279: LED3.A 94.23,35.23 92.75,33.75 92.75,31.7 93.2,31.25 97.1,31.25 98.7,32.85 98.7,53.6 97.55,54.75 97.55,55.6 96.9,56.25 95.02,56.25 LED4.A
  Top 0.406: T1.2 95,62.85 LED4.A
N$14
  Bottom 0.279: U1.94 30.72,47.98 30.2,48.5 R1.2
N$15
  Top 0.279: R5.1 93.26,51.99 LED4.K 98,50.73 98,33.7 96.99,32.69 LED3.K
N$17
  Bottom 0.279: LCD.LED 71.88,12.47 71.45,12.9 54.25,12.9 52.1,15.05 52.1,17.2 R6.1
NRST  (via drill 0.5)
  Top 0.279: v45.85,59.4 48.4,61.95 48.4,63.35 45.05,66.7 28.75,66.7 25.1,63.05 23.3,63.05 22.5,62.25 22.5,56.6 19.65,53.75 11.35,53.75 10.65,53.05 10.65,35.85 14.95,31.55 24.65,31.55 25.8,30.4 25.8,28.3 JP1.5
  Bottom 0.279: U1.14 45.81,52.59 45.85,52.55 v45.85,59.4
RF_IN  (via drill 0.5)
  Top 0.279: v34.1,43.55 34.1,29.9 34.25,29.75 v50.25,29.75 | v50.2,26.75 50.2,5.25 v49.85,4.9
  Bottom 0.279: U1.87 35.02,44.47 v34.1,43.55 | v50.25,29.75 50.25,26.8 v50.2,26.75 | v49.85,4.9 42.94,4.9 JP3.3
RF_OUT  (via drill 0.5)
  Top 0.279: v32.2,40.5 32.2,25.5 23.95,17.25 17.79,17.25 JP2.1
  Bottom 0.279: U1.77 33.23,39.47 v32.2,40.5
SPK_OUT  (via drill 0.5)
  Top 0.279: v47.5,19.55 37.4,19.55 v36.7,18.85
  Bottom 0.279: U1.61 46.29,20.76 v47.5,19.55 | v36.7,18.85 36.7,9 34.3,6.6 18,6.6 JP5.2
SW1  (via drill 0.5)
  Top 0.279: v50.85,50.85 50.85,48.6 46.2,46.7 24.05,46.7 21.88,44.53 14.23,44.53 13.8,44.1 12.44,44.1 SW1.SW+
  Bottom 0.279: 50.8,51.25 50.85,51.2 v50.85,50.85 50.81,50.89 U1.24
SWCLK  (via drill 0.5)
  Top 0.279: v30.55,35.5 30.55,38.5 v30.5,38.55
  Bottom 0.279: JP1.2 18.09,30.19 19.15,31.25 30.1,31.25 30.7,31.85 30.7,35.35 v30.55,35.5 | v30.5,38.55 30.95,39 34.85,39 34.86,38.99 U1.76
SWDIO
  Bottom 0.279: U1.72 40.8,32.8 42.1,31.5 42.1,23.1 41.15,22.15 23.9,22.15 23.1,22.95 23.1,28.14 JP1.4
WIFI_ES  (via drill 0.5, 0.6)
  Top 0.279: v43.5,28.15 56.05,28.15 57.2,23.05
  Top 0.305: 57.2,23.05 v57.2,20.9 | WIFI.10 84.85,23.05 81.8,20 v74,20
  Bottom 0.279: U1.67 43.29,28.36 v43.5,28.15
  Bottom 0.305: v57.2,20.9 57.25,20.9 58.1,20.05 73.95,20.05 v74,20
WIFI_RX  (via drill 0.5, 0.6)
  Top 0.279: v50.55,46.05 55.35,46.05 55.8,45.7 55.8,37.4 59.55,34.1 67.6,34.1
  Top 0.305: v68.4,25 68.4,33.3 67.6,34.1
  Bottom 0.279: U1.92 49.61,46.99 v50.55,46.05
  Bottom 0.305: WIFI.20 68.35,25.05 v68.4,25
WIFI_RX2  (via drill 0.5, 0.6)
  Top 0.279: v52.75,53.45 53.45,53.45 55.05,55.05 62.85,55.05 63.1,54.8 63.1,52.05 v63.05,52
  Top 0.305: v80.45,25.35 71.35,25.35 70.6,26.1 70.6,28.8 v70.35,29.05
  Bottom 0.279: U1.25 51.29,53.74 51.45,53.9 52.3,53.9 v52.75,53.45 | v63.05,52 63.05,50.85 63.95,49.95 76.3,49.95 79.85,46.4 79.85,29.8
  Bottom 0.305: 79.85,29.8 79.85,25.95 v80.45,25.35 | v70.35,29.05 WIFI.22
WIFI_TX  (via drill 0.5, 0.6)
  Top 0.279: v50.75,47.4 55.75,47.4 57.45,45.7 57.45,38.4 59.8,36.05 74.8,36.05 76.3,34.55 76.3,27.5
  Top 0.305: v72.85,27.05 75.85,27.05 76.3,27.5
  Bottom 0.279: U1.93 50.68,47.47 v50.75,47.4
  Bottom 0.305: WIFI.21 v72.85,27.05
WIFI_TX2  (via drill 0.5)
  Top 0.279: v55.15,51.4 60.05,51.4 61.45,49.55 61.45,48.5 v62.05,47.9
  Bottom 0.279: U1.26 55.18,50.97 v55.15,51.4 | v62.05,47.9 69.2,47.9 73.1,44
  Bottom 0.305: 73.1,44 73.1,37.6 72.45,36.95 61.22,36.95 WIFI.26

### Text on the board
tPlace: www.r00li.com | Rhome v3 - board 1.1